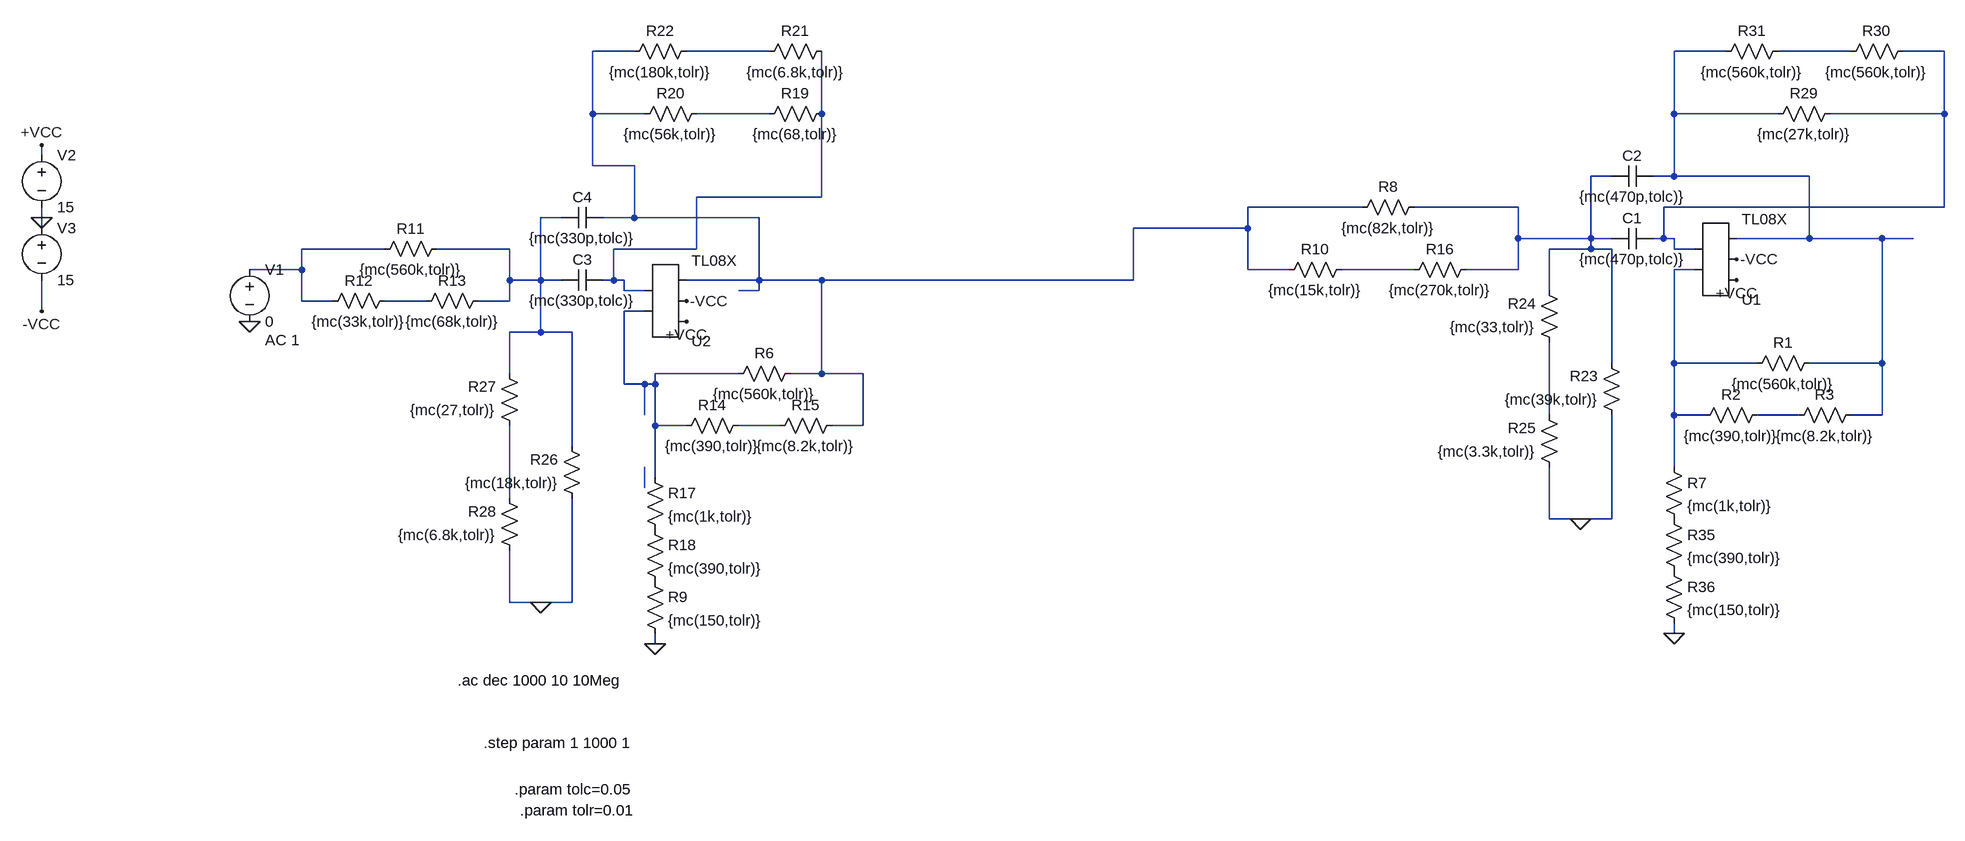
[diagram p0: schematic Cascada.asc]
Cascada.asc, the LTspice schematic file:
Version 4
SHEET 1 2276 1028
WIRE -240 -208 -304 -208
WIRE -32 -208 -160 -208
WIRE 1440 -208 1360 -208
WIRE 1632 -208 1520 -208
WIRE 1776 -208 1712 -208
WIRE -304 -112 -304 -208
WIRE -224 -112 -304 -112
WIRE -32 -112 -144 -112
WIRE 48 -112 48 -208
WIRE 1360 -112 1360 -208
WIRE 1520 -112 1360 -112
WIRE 1776 -112 1776 -208
WIRE 1776 -112 1600 -112
WIRE -1152 -48 -1152 -64
WIRE -304 -32 -304 -112
WIRE -240 -32 -304 -32
WIRE 1264 -16 1232 -16
WIRE 1360 -16 1360 -112
WIRE 1360 -16 1328 -16
WIRE 1568 -16 1360 -16
WIRE 48 16 48 -112
WIRE 48 16 -144 16
WIRE 880 32 704 32
WIRE 1120 32 960 32
WIRE 1776 32 1776 -112
WIRE 1776 32 1344 32
WIRE -1152 48 -1152 32
WIRE -352 48 -384 48
WIRE -240 48 -240 -32
WIRE -240 48 -288 48
WIRE -48 48 -240 48
WIRE -1152 64 -1152 48
WIRE 704 64 704 32
WIRE 704 64 528 64
WIRE 1120 80 1120 32
WIRE 1232 80 1232 -16
WIRE 1232 80 1120 80
WIRE 1264 80 1232 80
WIRE 1344 80 1344 32
WIRE 1344 80 1328 80
WIRE 1360 80 1344 80
WIRE 1568 80 1568 -16
WIRE 1568 80 1456 80
WIRE 1680 80 1568 80
WIRE 1728 80 1680 80
WIRE -624 96 -752 96
WIRE -432 96 -544 96
WIRE -144 96 -144 16
WIRE -144 96 -272 96
WIRE 1232 96 1232 80
WIRE 1232 96 1168 96
WIRE 1264 96 1232 96
WIRE 1360 96 1360 80
WIRE 1392 96 1360 96
WIRE -752 128 -752 96
WIRE -752 128 -832 128
WIRE 704 128 704 64
WIRE 768 128 704 128
WIRE 960 128 848 128
WIRE 1120 128 1120 80
WIRE 1120 128 1040 128
WIRE 1392 128 1360 128
WIRE -432 144 -432 96
WIRE -384 144 -384 48
WIRE -384 144 -432 144
WIRE -352 144 -384 144
WIRE -272 144 -272 96
WIRE -272 144 -288 144
WIRE -256 144 -272 144
WIRE -48 144 -48 48
WIRE -48 144 -160 144
WIRE 48 144 -48 144
WIRE 528 144 528 64
WIRE 528 144 48 144
WIRE -256 160 -256 144
WIRE -224 160 -256 160
WIRE -48 160 -48 144
WIRE -48 160 -80 160
WIRE 1168 160 1168 96
WIRE -752 176 -752 128
WIRE -704 176 -752 176
WIRE -560 176 -624 176
WIRE -432 176 -432 144
WIRE -432 176 -480 176
WIRE -1152 192 -1152 144
WIRE -224 192 -256 192
WIRE -384 224 -384 144
WIRE -384 224 -432 224
WIRE -336 224 -384 224
WIRE 1264 272 1264 96
WIRE 1360 272 1360 128
WIRE 1488 272 1360 272
WIRE 1680 272 1680 80
WIRE 1680 272 1568 272
WIRE -432 288 -432 224
WIRE -80 288 -208 288
WIRE 48 288 48 144
WIRE 48 288 0 288
WIRE 112 288 48 288
WIRE -256 304 -256 192
WIRE -224 304 -256 304
WIRE -208 304 -208 288
WIRE -208 304 -224 304
WIRE -224 352 -224 304
WIRE 1168 352 1168 240
WIRE 1360 352 1360 272
WIRE 1408 352 1360 352
WIRE 1552 352 1488 352
WIRE 1680 352 1680 272
WIRE 1680 352 1632 352
WIRE -208 368 -208 304
WIRE -160 368 -208 368
WIRE -16 368 -80 368
WIRE 112 368 112 288
WIRE 112 368 64 368
WIRE -336 400 -336 224
WIRE 1360 432 1360 352
WIRE -208 448 -208 368
WIRE -224 464 -224 432
WIRE -432 480 -432 368
WIRE 1168 512 1168 432
WIRE 1216 512 1168 512
WIRE 1264 512 1264 352
WIRE 1264 512 1216 512
WIRE -432 640 -432 560
WIRE -384 640 -432 640
WIRE -336 640 -336 480
WIRE -336 640 -384 640
WIRE 1360 688 1360 672
WIRE -208 704 -208 688
FLAG -832 208 0
FLAG -1152 48 0
FLAG -1152 192 -VCC
FLAG -1152 -64 +VCC
FLAG -160 208 +VCC
FLAG -160 176 -VCC
FLAG 1456 144 +VCC
FLAG 1456 112 -VCC
FLAG -208 704 0
FLAG -384 640 0
FLAG 1216 512 0
FLAG 1360 688 0
SYMBOL AutoGenerated\\TL08X -192 176 M180
SYMATTR InstName U2
SYMBOL cap -288 128 R90
WINDOW 0 0 32 VBottom 2
WINDOW 3 32 32 VTop 2
SYMATTR InstName C3
SYMATTR Value {mc(330p,tolc)}
SYMBOL cap -288 32 R90
WINDOW 0 0 32 VBottom 2
WINDOW 3 32 32 VTop 2
SYMATTR InstName C4
SYMATTR Value {mc(330p,tolc)}
SYMBOL voltage -832 112 R0
WINDOW 123 24 124 Left 2
WINDOW 39 0 0 Left 0
SYMATTR InstName V1
SYMATTR Value 0
SYMATTR Value2 AC 1
SYMBOL voltage -1152 -64 R0
WINDOW 123 0 0 Left 0
WINDOW 39 0 0 Left 0
SYMATTR InstName V2
SYMATTR Value 15
SYMBOL voltage -1152 48 R0
WINDOW 123 0 0 Left 0
WINDOW 39 0 0 Left 0
SYMATTR InstName V3
SYMATTR Value 15
SYMBOL AutoGenerated\\TL08X 1424 112 M180
SYMATTR InstName U1
SYMBOL cap 1328 64 R90
WINDOW 0 0 32 VBottom 2
WINDOW 3 32 32 VTop 2
SYMATTR InstName C1
SYMATTR Value {mc(470p,tolc)}
SYMBOL cap 1328 -32 R90
WINDOW 0 0 32 VBottom 2
WINDOW 3 32 32 VTop 2
SYMATTR InstName C2
SYMATTR Value {mc(470p,tolc)}
SYMBOL res -528 80 R90
WINDOW 0 0 56 VBottom 2
WINDOW 3 32 56 VTop 2
SYMATTR InstName R11
SYMATTR Value {mc(560k,tolr)}
SYMBOL res -608 160 R90
WINDOW 0 0 56 VBottom 2
WINDOW 3 32 56 VTop 2
SYMATTR InstName R12
SYMATTR Value {mc(33k,tolr)}
SYMBOL res -464 160 R90
WINDOW 0 0 56 VBottom 2
WINDOW 3 32 56 VTop 2
SYMATTR InstName R13
SYMATTR Value {mc(68k,tolr)}
SYMBOL res 16 272 R90
WINDOW 0 0 56 VBottom 2
WINDOW 3 32 56 VTop 2
SYMATTR InstName R6
SYMATTR Value {mc(560k,tolr)}
SYMBOL res -64 352 R90
WINDOW 0 0 56 VBottom 2
WINDOW 3 32 56 VTop 2
SYMATTR InstName R14
SYMATTR Value {mc(390,tolr)}
SYMBOL res 80 352 R90
WINDOW 0 0 56 VBottom 2
WINDOW 3 32 56 VTop 2
SYMATTR InstName R15
SYMATTR Value {mc(8.2k,tolr)}
SYMBOL res -224 432 R0
SYMATTR InstName R17
SYMATTR Value {mc(1k,tolr)}
SYMBOL res -224 512 R0
SYMATTR InstName R18
SYMATTR Value {mc(390,tolr)}
SYMBOL res -48 -96 R270
WINDOW 0 32 56 VTop 2
WINDOW 3 0 56 VBottom 2
SYMATTR InstName R19
SYMATTR Value {mc(68,tolr)}
SYMBOL res -240 -96 R270
WINDOW 0 32 56 VTop 2
WINDOW 3 0 56 VBottom 2
SYMATTR InstName R20
SYMATTR Value {mc(56k,tolr)}
SYMBOL res -48 -192 R270
WINDOW 0 32 56 VTop 2
WINDOW 3 0 56 VBottom 2
SYMATTR InstName R21
SYMATTR Value {mc(6.8k,tolr)}
SYMBOL res -256 -192 R270
WINDOW 0 32 56 VTop 2
WINDOW 3 0 56 VBottom 2
SYMATTR InstName R22
SYMATTR Value {mc(180k,tolr)}
SYMBOL res -224 592 R0
SYMATTR InstName R9
SYMATTR Value {mc(150,tolr)}
SYMBOL res 976 16 R90
WINDOW 0 0 56 VBottom 2
WINDOW 3 32 56 VTop 2
SYMATTR InstName R8
SYMATTR Value {mc(82k,tolr)}
SYMBOL res 864 112 R90
WINDOW 0 0 56 VBottom 2
WINDOW 3 32 56 VTop 2
SYMATTR InstName R10
SYMATTR Value {mc(15k,tolr)}
SYMBOL res 1056 112 R90
WINDOW 0 0 56 VBottom 2
WINDOW 3 32 56 VTop 2
SYMATTR InstName R16
SYMATTR Value {mc(270k,tolr)}
SYMBOL res 1280 368 R180
WINDOW 0 36 76 Left 2
WINDOW 3 36 40 Left 2
SYMATTR InstName R23
SYMATTR Value {mc(39k,tolr)}
SYMBOL res 1184 256 R180
WINDOW 0 36 76 Left 2
WINDOW 3 36 40 Left 2
SYMATTR InstName R24
SYMATTR Value {mc(33,tolr)}
SYMBOL res 1184 448 R180
WINDOW 0 36 76 Left 2
WINDOW 3 36 40 Left 2
SYMATTR InstName R25
SYMATTR Value {mc(3.3k,tolr)}
SYMBOL res -320 496 R180
WINDOW 0 36 76 Left 2
WINDOW 3 36 40 Left 2
SYMATTR InstName R26
SYMATTR Value {mc(18k,tolr)}
SYMBOL res -416 384 R180
WINDOW 0 36 76 Left 2
WINDOW 3 36 40 Left 2
SYMATTR InstName R27
SYMATTR Value {mc(27,tolr)}
SYMBOL res -416 576 R180
WINDOW 0 36 76 Left 2
WINDOW 3 36 40 Left 2
SYMATTR InstName R28
SYMATTR Value {mc(6.8k,tolr)}
SYMBOL res 1504 -96 R270
WINDOW 0 32 56 VTop 2
WINDOW 3 0 56 VBottom 2
SYMATTR InstName R29
SYMATTR Value {mc(27k,tolr)}
SYMBOL res 1616 -192 R270
WINDOW 0 32 56 VTop 2
WINDOW 3 0 56 VBottom 2
SYMATTR InstName R30
SYMATTR Value {mc(560k,tolr)}
SYMBOL res 1424 -192 R270
WINDOW 0 32 56 VTop 2
WINDOW 3 0 56 VBottom 2
SYMATTR InstName R31
SYMATTR Value {mc(560k,tolr)}
SYMBOL res 1584 256 R90
WINDOW 0 0 56 VBottom 2
WINDOW 3 32 56 VTop 2
SYMATTR InstName R1
SYMATTR Value {mc(560k,tolr)}
SYMBOL res 1504 336 R90
WINDOW 0 0 56 VBottom 2
WINDOW 3 32 56 VTop 2
SYMATTR InstName R2
SYMATTR Value {mc(390,tolr)}
SYMBOL res 1648 336 R90
WINDOW 0 0 56 VBottom 2
WINDOW 3 32 56 VTop 2
SYMATTR InstName R3
SYMATTR Value {mc(8.2k,tolr)}
SYMBOL res 1344 416 R0
SYMATTR InstName R7
SYMATTR Value {mc(1k,tolr)}
SYMBOL res 1344 496 R0
SYMATTR InstName R35
SYMATTR Value {mc(390,tolr)}
SYMBOL res 1344 576 R0
SYMATTR InstName R36
SYMATTR Value {mc(150,tolr)}
TEXT -512 760 Left 2 !.ac dec 1000 10 10Meg
TEXT -472 856 Left 2 !.step param 1 1000 1
TEXT -424 928 Left 2 !.param tolc=0.05
TEXT -416 960 Left 2 !.param tolr=0.01

The netlist it stands for:
* Cascada.asc
* U2: TL08X (symbol AutoGenerated\TL08X not available, pins judged from their places): pin1=N014 pin2=N007 pin3=+VCC pin4=-VCC pin5=N001
C3 N007 N009 {mc(330p,tolc)}
C4 N001 N009 {mc(330p,tolc)}
V1 N010 0 0 AC 1
V2 +VCC 0 15
V3 0 -VCC 15
* U1: TL08X (symbol AutoGenerated\TL08X not available, pins judged from their places): pin1=N012 pin2=N005 pin3=+VCC pin4=-VCC pin5=N003
C1 N005 N008 {mc(470p,tolc)}
C2 N003 N008 {mc(470p,tolc)}
R11 N009 N010 {mc(560k,tolr)}
R12 N013 N010 {mc(33k,tolr)}
R13 N009 N013 {mc(68k,tolr)}
R6 N001 N014 {mc(560k,tolr)}
R14 N017 N014 {mc(390,tolr)}
R15 N001 N017 {mc(8.2k,tolr)}
R17 N014 P001 {mc(1k,tolr)}
R18 P001 P002 {mc(390,tolr)}
R19 N006 N007 {mc(68,tolr)}
R20 N001 N006 {mc(56k,tolr)}
R21 N002 N007 {mc(6.8k,tolr)}
R22 N001 N002 {mc(180k,tolr)}
R9 P002 0 {mc(150,tolr)}
R8 N008 N001 {mc(82k,tolr)}
R10 N011 N001 {mc(15k,tolr)}
R16 N008 N011 {mc(270k,tolr)}
R23 0 N008 {mc(39k,tolr)}
R24 N015 N008 {mc(33,tolr)}
R25 0 N015 {mc(3.3k,tolr)}
R26 0 N009 {mc(18k,tolr)}
R27 N019 N009 {mc(27,tolr)}
R28 0 N019 {mc(6.8k,tolr)}
R29 N003 N005 {mc(27k,tolr)}
R30 N004 N005 {mc(560k,tolr)}
R31 N003 N004 {mc(560k,tolr)}
R1 N003 N012 {mc(560k,tolr)}
R2 N016 N012 {mc(390,tolr)}
R3 N003 N016 {mc(8.2k,tolr)}
R7 N012 P003 {mc(1k,tolr)}
R35 P003 P004 {mc(390,tolr)}
R36 P004 0 {mc(150,tolr)}
.ac dec 1000 10 10Meg
.step param 1 1000 1
.param tolc=0.05
.param tolr=0.01
.backanno
.end